# EAGLE design flashykomal (EAGLE 9.1.3)
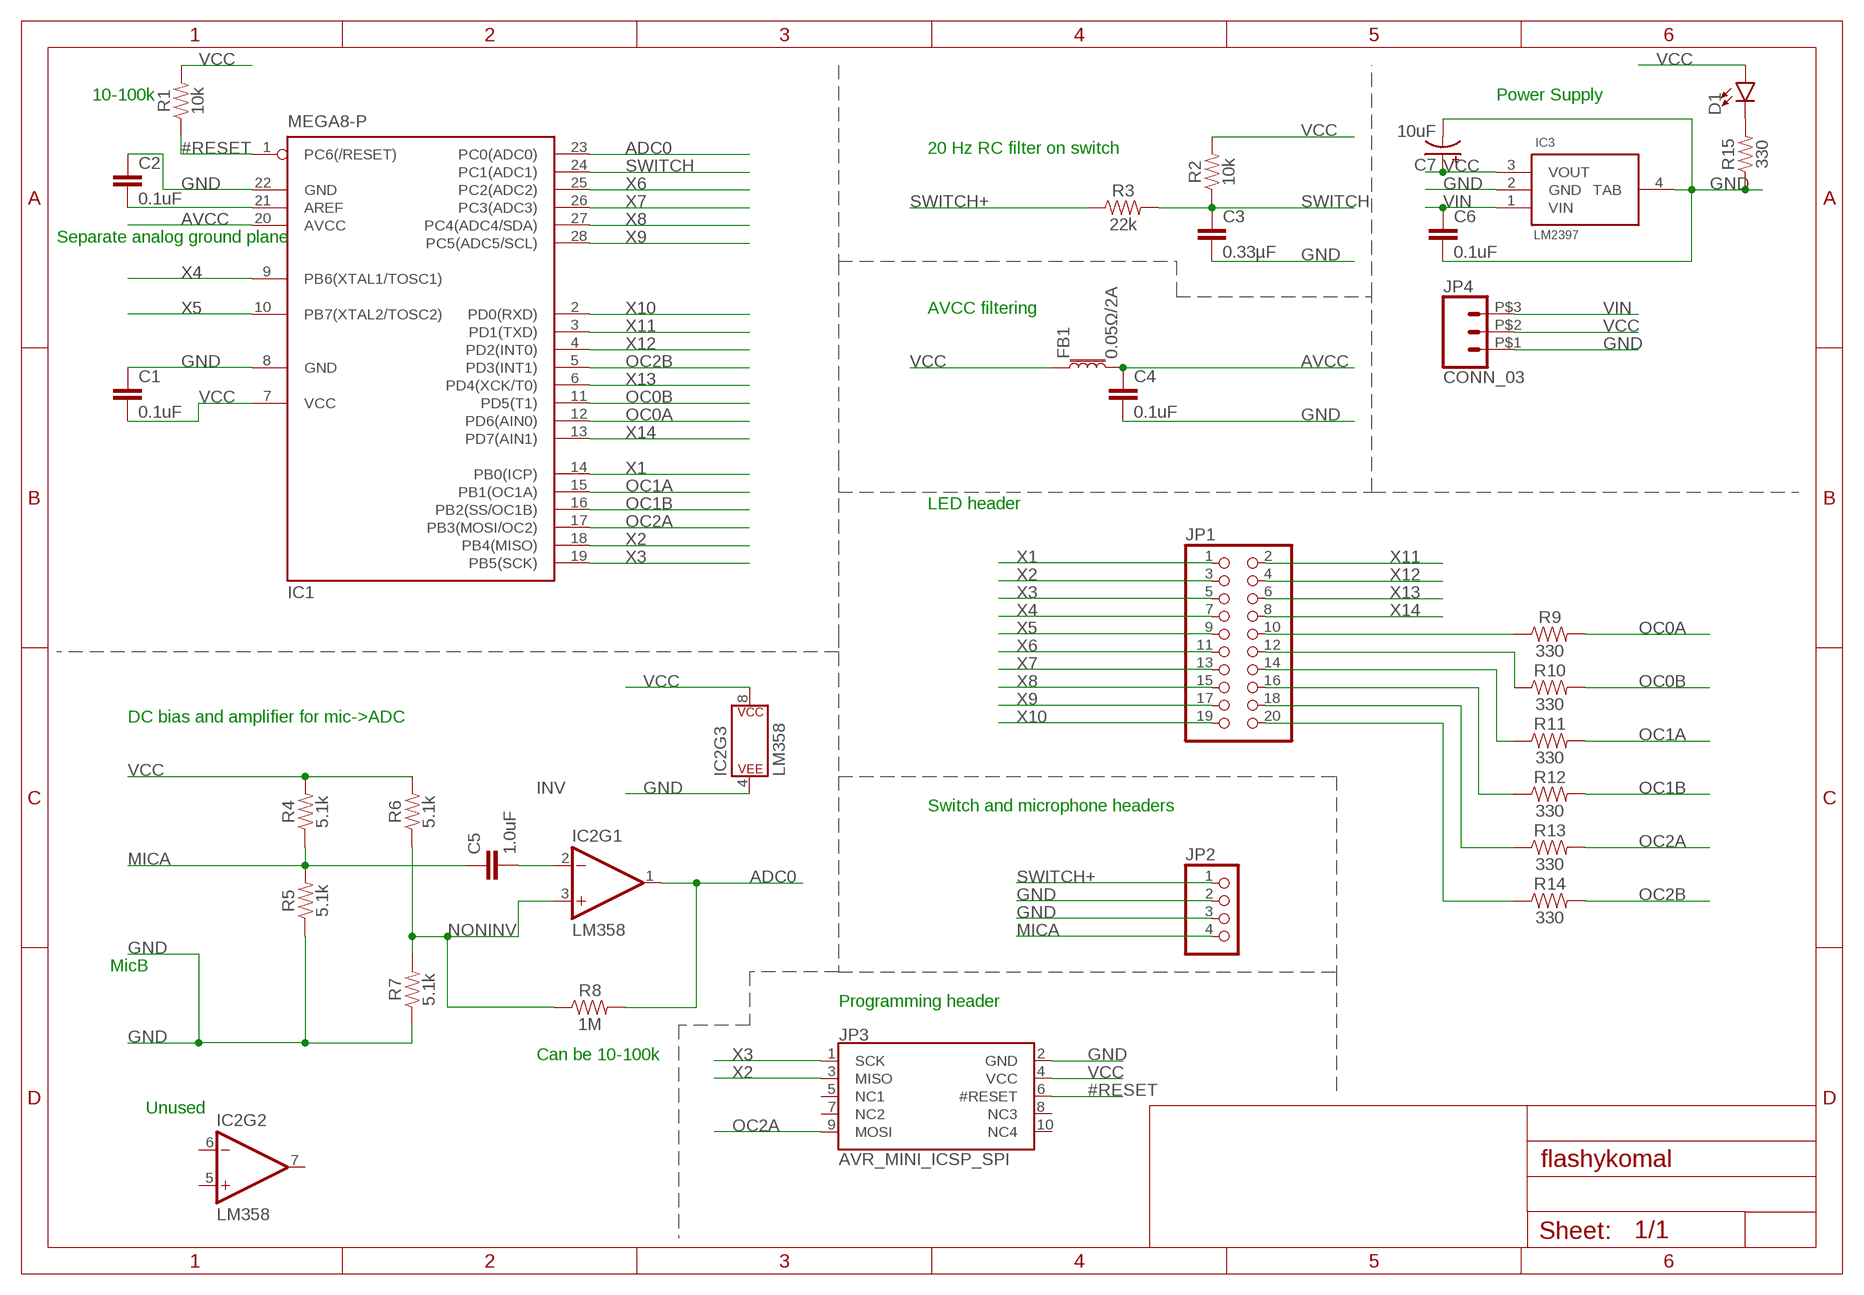
[diagram p0: schematic, sheet 1]

## Parts
C1  0.1uF  0.1UF-0603-25V-(+80/-20%)  [0603]
C2  0.1uF  0.1UF-0603-25V-(+80/-20%)  [0603]
C3  0.33µF  0.33UF/330NF-0805-50V-10%  [0805]
C4  0.1uF  0.1UF-0603-25V-(+80/-20%)  [0603]
C5  1.0uF  1.0UF-0603-16V-10%  [0603]
C6  0.1uF  0.1UF-0603-25V-(+80/-20%)  [0603]
C7  10uF  10UF-POLAR-RADIAL-2.5MM-25V-20%  [CPOL-RADIAL-2.5MM-5MM]
D1  LED0603  [LED-0603]
FB1  0.05Ω/2A  FERRITE_BEAD-0603  [0603]
IC1  MEGA8-P  [DIL28-3]
IC2  LM358  [DIP08]
IC3  LM2397  [SOT223]
JP1  PINHD-2X10  [2X10]
JP2  PINHD-1X4  [1X04]
JP3  AVR_MINI_ICSP_SPI  [SAMTECH_FTSH-105-01]
JP4  CONN_03  [PH1X3-381]
R1  10k  10KOHM-0603-1/10W-1%  [0603]
R2  10k  10KOHM-0603-1/10W-1%  [0603]
R3  22k  22KOHM-0603-1/10W-1%  [0603]
R4  5.1k  5.1KOHM5.1KOHM-0603-1/10W-1%  [0603]
R5  5.1k  5.1KOHM5.1KOHM-0603-1/10W-1%  [0603]
R6  5.1k  5.1KOHM5.1KOHM-0603-1/10W-1%  [0603]
R7  5.1k  5.1KOHM5.1KOHM-0603-1/10W-1%  [0603]
R8  1M  1MOHM-0603-1/4W-5%  [0603]
R9  330  330OHM-0603-1/10W-1%  [0603]
R10  330  330OHM-0603-1/10W-1%  [0603]
R11  330  330OHM-0603-1/10W-1%  [0603]
R12  330  330OHM-0603-1/10W-1%  [0603]
R13  330  330OHM-0603-1/10W-1%  [0603]
R14  330  330OHM-0603-1/10W-1%  [0603]
R15  330  330OHM-0603-1/10W-1%  [0603]

## Nets
#RESET: IC1.1(PC6(/RESET)) JP3.6(#RESET) R1.1
ADC0: IC1.23(PC0(ADC0)) IC2.1(OUT) R8.2
AVCC: C4.1 FB1.2 IC1.20(AVCC)
GND: C1.1 C2.1 C3.2 C4.2 C6.2 C7.2(-) IC1.8(GND) IC1.22(GND) IC2.4(P$V-) IC3.2(GND) IC3.4(TAB) JP2.2 JP2.3 JP3.2(GND) JP4.P$1 R5.1 R7.1 R15.1
INV: C5.2 IC2.2(-IN)
MICA: C5.1 JP2.4 R4.1 R5.2
N$1: D1.C R15.2
N$2: C2.2 IC1.21(AREF)
N$17: JP1.10 R9.1
N$18: JP1.12 R10.1
N$19: JP1.14 R11.1
N$20: JP1.16 R12.1
N$21: JP1.18 R13.1
N$22: JP1.20 R14.1
NONINV: IC2.3(+IN) R6.1 R7.2 R8.1
OC0A: IC1.12(PD6(AIN0)) R9.2
OC0B: IC1.11(PD5(T1)) R10.2
OC1A: IC1.15(PB1(OC1A)) R11.2
OC1B: IC1.16(PB2(SS/OC1B)) R12.2
OC2A: IC1.17(PB3(MOSI/OC2)) JP3.9(MOSI) R13.2
OC2B: IC1.5(PD3(INT1)) R14.2
SWITCH: C3.1 IC1.24(PC1(ADC1)) R2.1 R3.2
SWITCH+: JP2.1 R3.1
VCC: C1.2 C7.1(+) D1.A FB1.1 IC1.7(VCC) IC2.8(P$V+) IC3.3(VOUT) JP3.4(VCC) JP4.P$2 R1.2 R2.2 R4.2 R6.2
VIN: C6.1 IC3.1(VIN) JP4.P$3
X1: IC1.14(PB0(ICP)) JP1.1
X2: IC1.18(PB4(MISO)) JP1.3 JP3.3(MISO)
X3: IC1.19(PB5(SCK)) JP1.5 JP3.1(SCK)
X4: IC1.9(PB6(XTAL1/TOSC1)) JP1.7
X5: IC1.10(PB7(XTAL2/TOSC2)) JP1.9
X6: IC1.25(PC2(ADC2)) JP1.11
X7: IC1.26(PC3(ADC3)) JP1.13
X8: IC1.27(PC4(ADC4/SDA)) JP1.15
X9: IC1.28(PC5(ADC5/SCL)) JP1.17
X10: IC1.2(PD0(RXD)) JP1.19
X11: IC1.3(PD1(TXD)) JP1.2
X12: IC1.4(PD2(INT0)) JP1.4
X13: IC1.6(PD4(XCK/T0)) JP1.6
X14: IC1.13(PD7(AIN1)) JP1.8
Unconnected: IC2.5(+IN) IC2.6(-IN) IC2.7(OUT) JP3.5(NC1) JP3.7(NC2) JP3.8(NC3) JP3.10(NC4)

## Notes on the sheet
- 10-100k | Power Supply
- 20 Hz RC filter on switch
- Separate analog ground plane
- AVCC filtering
- LED header
- DC bias and amplifier for mic->ADC
- Switch and microphone headers
- MicB
- Programming header
- Can be 10-100k
- Unused

## Library data of the parts
C1 C2 C4 C6 = SparkFun-Capacitors:0.1UF: 0.1µF ceramic capacitors A capacitor is a passive two-terminal electrical component used to store electrical energy temporarily in an electric field.; PROD_ID: CAP-00810
C3 = SparkFun-Capacitors:0.33UF/330NF: 0.33µF/330nF ceramic capacitors A capacitor is a passive two-terminal electrical component used to store electrical energy temporarily in an electric field.; PROD_ID: CAP-08469
C5 = SparkFun-Capacitors:1.0UF: 1µF ceramic capacitors A capacitor is a passive two-terminal electrical component used to store electrical energy temporarily in an electric field.; PROD_ID: CAP-00868
C7 = SparkFun-Capacitors:10UF-POLAR: 10.0µF polarized capacitors A capacitor is a passive two-terminal electrical component used to store electrical energy temporarily in an electric field.; PROD_ID: CAP-08440
D1 = SparkFun-LED:LED: LED (Generic) Standard schematic elements and footprints for 5mm, 3mm, 1206, and 0603 sized LEDs. Generic LEDs with no color specified.
FB1 = SparkFun-Coils:FERRITE_BEAD: Ferrite Bead (blocks, cores, rings, chokes, etc.) Inductor with layers of ferrite used to suppress high frequencies. Often used to isolate high frequency noise. SparkFun Products: IOIO-OTG - V2.2 <https://www.sparkfun.com/products/13613> SparkFun SAMD21 Mini Breakout <https://www.sparkfun.com/products/13664> SparkFun 6 Degrees of Freedom Breakout - LSM6DS3 <https://www.sparkfun.com/products/13339> SparkFun SAMD21 Dev Breakout <https://www.sparkfun.com/products/13672>; PROD_ID: NDUC-13805; VALUE: 30Ω/1.8A
IC1 = atmel:MEGA8-P: MICROCONTROLLER 8 Kbytes FLASH, 1 kbytes SRAM, 512 bytes EEPROM, USART, 4-channel 10 bit ADC, 2-channel 8 bit ADC Pin compatible with Atmega48, ATMega88, ATMega168 Source: avr.lbr; OC_FARNELL: unknown; OC_NEWARK: unknown
IC2 = SparkFun-IC-Amplifiers:LM358: LM358 Jellybean op-amp Datasheet <http://www.sparkfun.com/datasheets/Components/General/LM358.pdf> SparkFun Products Op-Amp (Thru-Hole) - LM358 <https://www.sparkfun.com/products/9456> (COM-09456); PROD_ID: IC-09172
IC3 = atmel-samd:LM2397
JP1 = pinhead:PINHD-2X10: PIN HEADER
JP2 = pinhead:PINHD-1X4: PIN HEADER
JP3 = atmel-samd:AVR_MINI_ICSP_SPI
JP4 = atmel-samd:CONN_03
R1 R2 = SparkFun-Resistors:10KOHM: 10kΩ resistor A resistor is a passive two-terminal electrical component that implements electrical resistance as a circuit element. Resistors act to reduce current flow, and, at the same time, act to lower voltage levels within circuits. - Wikipedia; PROD_ID: RES-00824
R3 = SparkFun-Resistors:22KOHM: 22kΩ resistor A resistor is a passive two-terminal electrical component that implements electrical resistance as a circuit element. Resistors act to reduce current flow, and, at the same time, act to lower voltage levels within circuits. - Wikipedia; PROD_ID: RES-07853
R4-R7 = SparkFun-Resistors:5.1KOHM; PROD_ID: RES-12083
R8 = SparkFun-Resistors:1MOHM: 1MΩ resistor A resistor is a passive two-terminal electrical component that implements electrical resistance as a circuit element. Resistors act to reduce current flow, and, at the same time, act to lower voltage levels within circuits. - Wikipedia; PROD_ID: RES-07868
R9-R15 = SparkFun-Resistors:330OHM: 330Ω resistor A resistor is a passive two-terminal electrical component that implements electrical resistance as a circuit element. Resistors act to reduce current flow, and, at the same time, act to lower voltage levels within circuits. - Wikipedia; PROD_ID: RES-00818

## Net classes
0 default: width 0.254 mm

## Board
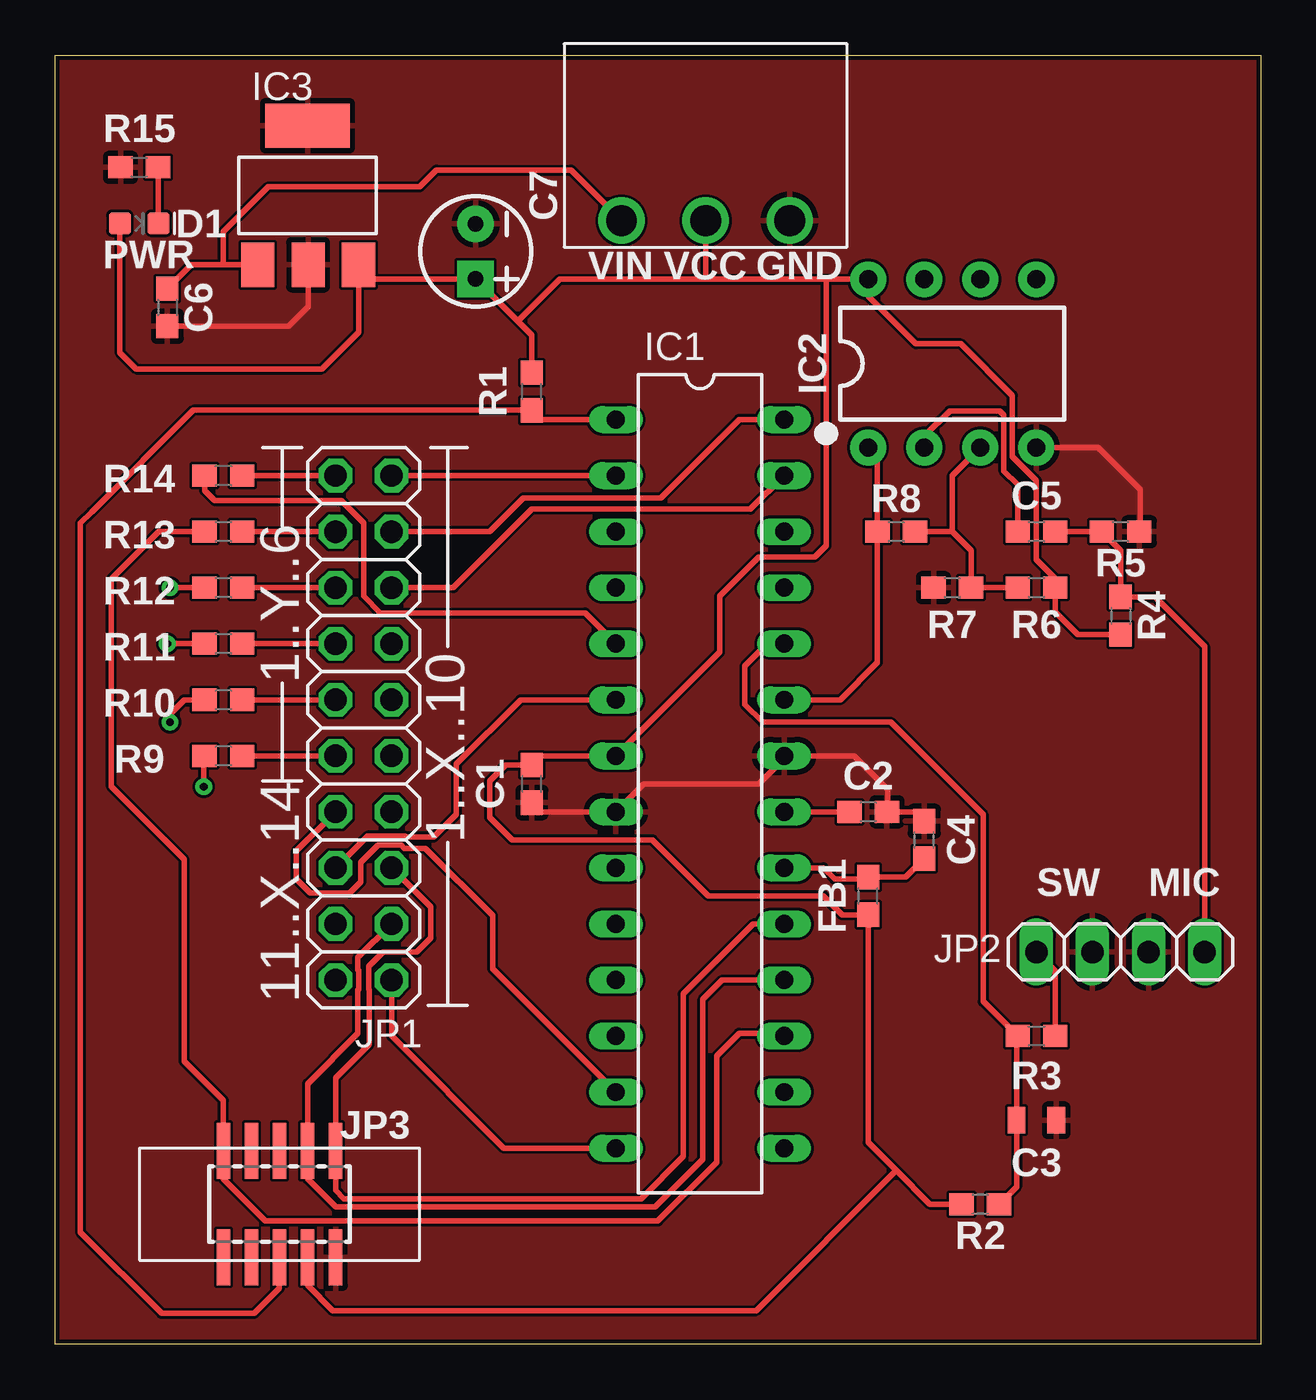
[diagram p1: board, top side]
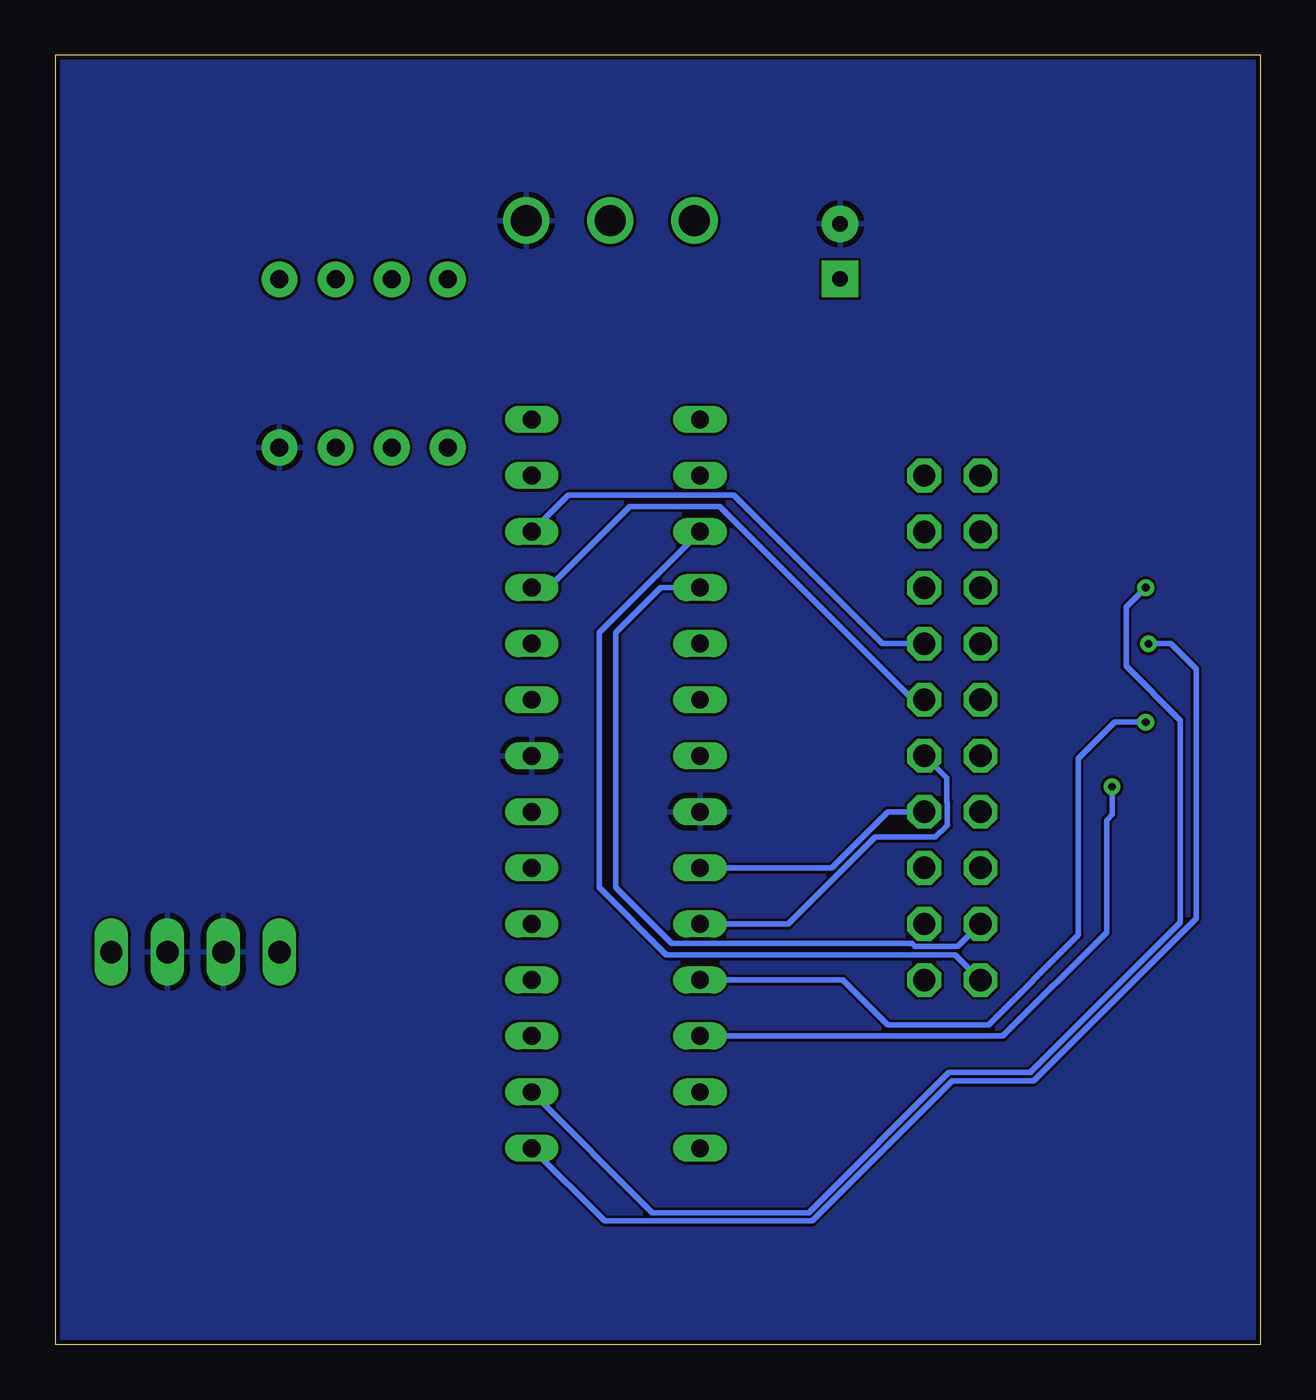
[diagram p2: board, bottom side, seen from below]

Size 54.61 x 58.42 mm. Coordinates in mm from the lower left corner, seen from the top.
Outline: 0,0 0,58.42 54.61,58.42 54.61,0 0,0
Copper layers (1*16): Top 0.035mm / dielectric 1.5mm / Bottom 0.035mm
Design rules "jlcpcb": minimum track width 5mil, minimum drill 0.3mm, track to track 5mil, track to pad 5mil, pad to pad 5mil, via to via 5mil, smd to smd 5mil, copper to edge 0.2mm, drill to drill 6mil, minimum pad ring 3mil, minimum via ring 8mil, stop-mask expansion 0mil, vias tented up to drill 15mil, thermal gap 10mil

### Footprints (pad centres in the part's own frame; a part is rotated, then mirrored left to right if it is on the bottom)
0603 = smd 1.1 x 1: 1 -0.85,0; 2 0.85,0
0805 = smd 0.8 x 1.2: 1 -0.9,0; 2 0.9,0
CPOL-RADIAL-2.5MM-5MM = drill 0.7 pad 1.651 square: 1 1.25,0 | drill 0.7 pad 1.651: 2 -1.25,0
LED-0603 = smd 1 x 1: A -0.877,0; C 0.877,0
DIL28-3 = drill 0.813 long: 1 -16.51,-3.81; 2 -13.97,-3.81; 3 -11.43,-3.81; 4 -8.89,-3.81; 5 -6.35,-3.81; 6 -3.81,-3.81; 7 -1.27,-3.81; 8 1.27,-3.81; 9 3.81,-3.81; 10 6.35,-3.81; 11 8.89,-3.81; 12 11.43,-3.81; 13 13.97,-3.81; 14 16.51,-3.81; 15 16.51,3.81; 16 13.97,3.81; 17 11.43,3.81; 18 8.89,3.81; 19 6.35,3.81; 20 3.81,3.81; 21 1.27,3.81; 22 -1.27,3.81; 23 -3.81,3.81; 24 -6.35,3.81; 25 -8.89,3.81; 26 -11.43,3.81; 27 -13.97,3.81; 28 -16.51,3.81
DIP08 = drill 0.813 pad 1.626: 1 -3.81,-3.81; 2 -1.27,-3.81; 3 1.27,-3.81; 4 3.81,-3.81; 5 3.81,3.81; 6 1.27,3.81; 7 -1.27,3.81; 8 -3.81,3.81
SOT223 = smd 1.499 x 2.007: 1 -2.261,-3.15; 2 0.025,-3.15; 3 2.311,-3.15 | smd 3.81 x 2.007: 4 0,3.15
2X10 = drill 1.016 octagon: 1 -11.43,-1.27; 2 -11.43,1.27; 3 -8.89,-1.27; 4 -8.89,1.27; 5 -6.35,-1.27; 6 -6.35,1.27; 7 -3.81,-1.27; 8 -3.81,1.27; 9 -1.27,-1.27; 10 -1.27,1.27; 11 1.27,-1.27; 12 1.27,1.27; 13 3.81,-1.27; 14 3.81,1.27; 15 6.35,-1.27; 16 6.35,1.27; 17 8.89,-1.27; 18 8.89,1.27; 19 11.43,-1.27; 20 11.43,1.27
1X04 = drill 1.016 long: 1 -3.81,0; 2 -1.27,0; 3 1.27,0; 4 3.81,0
SAMTECH_FTSH-105-01 = smd 0.61 x 2.54: 1 -2.54,-2.413; 2 -2.54,2.413; 3 -1.27,-2.413; 4 -1.27,2.413; 5 0,-2.413; 6 0,2.413; 7 1.27,-2.413; 8 1.27,2.413; 9 2.54,-2.413; 10 2.54,2.413
PH1X3-381 = drill 1.4: P$1 -3.81,0; P$2 0,0; P$3 3.81,0

### Placement (x,y rotation side)
C1  21.59,25.4 90 top
C2  36.83,24.13 180 top
C3  44.45,10.16 0 top
C4  39.37,22.86 90 top
C5  44.45,36.83 180 top
C6  5.08,46.99 270 top
C7  19.05,49.53 270 top
D1  3.81,50.8 0 top
FB1  36.83,20.32 90 top
IC1  29.21,25.4 270 top
IC2  40.64,44.45 0 top
IC3  11.43,52.07 0 top
JP1  13.97,27.94 90 top
JP2  48.26,17.78 0 top
JP3  10.16,6.35 180 top
JP4  29.46,50.93 180 top
R1  21.59,43.18 90 top
R2  41.91,6.35 180 top
R3  44.45,13.97 180 top
R4  48.26,33.02 270 top
R5  48.26,36.83 180 top
R6  44.45,34.29 0 top
R7  40.64,34.29 0 top
R8  38.1,36.83 180 top
R9  7.62,26.67 180 top
R10  7.62,29.21 180 top
R11  7.62,31.75 180 top
R12  7.62,34.29 180 top
R13  7.62,36.83 180 top
R14  7.62,39.37 180 top
R15  3.81,53.34 0 top

### Tracks (layer width: path | path; a pad name or v marks a point on that pad's centre or on a via)
#RESET
  Top 0.254: IC1.1 22.01,41.91 R1.1 6.26,42.33 1.65,37.72 1.14,37.21 1.14,5.08 4.83,1.4 9.02,1.4 10.16,2.54 JP3.6
ADC0
  Top 0.254: IC2.1 37.25,40.22 R8.2 37.25,30.9 35.56,29.21 IC1.23
AVCC
  Top 0.254: IC1.20 34.8,21.59 35.31,21.08 36.74,21.08 FB1.2 38.53,21.17 C4.1
GND
  Top 0.254: C6.2 10.58,46.14 11.46,47.02 IC3.2 | IC2.4 47.24,40.64 49.15,38.73 49.15,36.87 R5.1 | C4.2 38.95,24.13 37.72,24.13 | 37.72,24.13 C2.1 | IC1.22 33.15,26.67 | 33.15,26.67 36.2,26.67 37.72,25.15 37.72,24.13 | C1.1 22.01,24.13 IC1.8 26.67,25.4 31.88,25.4 33.15,26.67
  pour Top: -1.78,58.8 54.61,58.8 54.61,-1.27 54.61,-3.81 -2.54,-3.81 -2.54,58.42 -1.27,58.42
  pour Bottom: -2.54,58.42 54.61,58.42 54.61,-3.81 -2.54,-3.81
INV
  Top 0.254: C5.2 43.6,38.95 42.98,39.57 42.98,42.11 42.8,42.29 40.51,42.29 39.37,41.15 IC2.2
MICA
  Top 0.254: C5.1 R5.2 48.26,35.98 R4.1 49.82,33.87 52.07,31.62 JP2.4
N$1
  Top 0.254: R15.2 4.66,50.8 D1.C
N$2
  Top 0.254: C2.2 IC1.21
N$17
  Top 0.254: R9.1 JP1.10
N$18
  Top 0.254: R10.1 JP1.12
N$19
  Top 0.254: R11.1 JP1.14
N$20
  Top 0.254: R12.1 JP1.16
N$21
  Top 0.254: R13.1 JP1.18
N$22
  Top 0.254: R14.1 JP1.20
NONINV
  Top 0.254: R6.1 R7.2 41.49,35.98 40.64,36.83 | R8.1 40.64,36.83 | IC2.3 40.64,39.37 40.64,36.83
OC0A  (via drill 0.35)
  Top 0.254: v6.73,25.27 6.73,26.63 R9.2
  Bottom 0.254: IC1.12 11.68,13.97 6.99,18.67 6.99,23.75 6.73,24 v6.73,25.27
OC0B  (via drill 0.35)
  Top 0.254: v5.21,28.19 5.21,28.57 5.84,29.21 R10.2
  Bottom 0.254: IC1.11 18.92,16.51 16.89,14.48 12.32,14.48 8.26,18.54 8.26,26.54 6.6,28.19 v5.21,28.19
OC1A  (via drill 0.35)
  Top 0.254: v5.08,31.75 R11.2
  Bottom 0.254: IC1.15 29.72,5.59 20.32,5.59 13.97,11.94 10.29,11.94 2.92,19.3 2.92,30.61 4.06,31.75 v5.08,31.75
OC1B  (via drill 0.35)
  Top 0.254: v5.21,34.29 R12.2
  Bottom 0.254: IC1.16 27.56,5.97 20.48,5.97 14.13,12.32 10.45,12.32 3.63,19.13 3.63,28.27 6.1,30.73 6.1,33.4 v5.21,34.29
OC2A
  Top 0.254: R13.2 4.7,36.83 2.54,34.67 2.54,25.27 5.84,21.97 5.84,12.83 7.62,11.05 JP3.9 7.62,7.49 9.53,5.59 27.3,5.59 29.97,8.26 29.97,13.08 30.99,14.1 32.89,14.1 IC1.17
OC2B
  Top 0.254: R14.2 6.77,38.7 7.24,38.23 12.95,38.23 13.97,37.21 13.97,33.91 14.73,33.15 24,33.15 IC1.5
SWITCH
  Top 0.254: R2.1 43.55,7.14 C3.1 43.55,13.92 R3.2 42.04,15.53 42.04,24 37.85,28.19 32.05,28.19 31.24,29 31.24,30.73 32.26,31.75 IC1.24
SWITCH+
  Top 0.254: JP2.1 45.3,16.93 R3.1
VCC
  Top 0.254: 20.96,46.37 C7.1 14.38,48.28 IC3.3 13.74,45.87 12.06,44.2 3.68,44.2 2.93,44.95 D1.A | 20.96,46.37 21.59,45.74 R1.2 | 20.96,46.37 22.86,48.26 29.46,48.26 | 29.46,48.26 34.92,48.26 | 34.92,48.26 IC2.8 36.83,47.5 38.99,45.34 41.02,45.34 43.36,43 43.36,40.22 44.45,39.13 44.45,35.56 45.3,34.71 R6.2 45.3,33.19 46.32,32.17 R4.2 | 38.1,7.87 36.83,9.14 FB1.1 35.65,19.47 34.8,20.32 29.59,20.32 27.05,22.86 20.7,22.86 19.68,23.88 19.68,25.53 20.41,26.25 C1.2 22.01,26.67 IC1.7 30.1,31.37 30.1,33.91 31.88,35.69 34.42,35.69 34.92,36.2 34.92,48.26 | 38.1,7.87 39.62,6.35 R2.2 | JP3.4 11.43,2.67 12.57,1.52 31.75,1.52 38.1,7.87 | JP4.P$2 29.46,48.26
VIN
  Top 0.254: C6.1 6.16,48.92 7.62,48.92 | 7.62,48.92 IC3.1 | 7.62,48.92 7.62,50.42 9.65,52.45 16.51,52.45 17.27,53.21 23.37,53.21 JP4.P$3
X1
  Top 0.254: IC1.14 20.32,8.89 15.24,13.97 JP1.1
X2
  Top 0.254: JP1.3 13.72,17.53 13.72,16.97 13.74,16.94 13.74,16.08 13.72,16.05 13.72,14.1 11.43,11.81 JP3.3 11.43,7.49 12.7,6.22 27.18,6.22 29.34,8.38 29.34,15.62 30.23,16.51 IC1.18
X3
  Top 0.254: JP1.5 17.02,19.81 17.02,18.41 16.38,17.78 14.86,17.78 14.2,17.12 14.2,16.08 14.22,16.05 14.22,13.59 12.7,12.06 JP3.1 12.7,6.99 13.08,6.6 26.54,6.6 28.45,8.51 28.45,15.88 31.62,19.05 IC1.19
X4
  Bottom 0.254: IC1.9 19.43,21.59 16.89,24.13 JP1.7
X5
  Bottom 0.254: IC1.10 21.4,19.05 17.46,22.99 14.73,22.99 14.2,23.52 14.2,24.56 14.22,24.59 14.22,25.65 JP1.9
X6
  Bottom 0.254: JP1.11 15.75,29.21 24.51,37.97 28.57,37.97 32.26,34.29 IC1.25
X7
  Bottom 0.254: JP1.13 17.14,31.75 23.88,38.48 31.37,38.48 IC1.26
X8
  Top 0.254: IC1.27 31.5,37.85 21.59,37.85 18.03,34.29 JP1.15
X9
  Top 0.254: IC1.28 30.99,41.91 27.43,38.35 21.21,38.35 19.68,36.83 JP1.17
X10
  Top 0.254: IC1.2 JP1.19
X11
  Bottom 0.254: IC1.3 29.97,32.26 29.97,20.7 26.92,17.65 13.84,17.65 JP1.2
X12
  Bottom 0.254: IC1.4 27.18,34.29 29.21,32.26 29.21,20.7 26.67,18.16 15.79,18.16 15.66,18.03 13.72,18.03 JP1.4
X13
  Top 0.254: IC1.6 21.08,29.21 18.16,26.29 18.16,24 17.14,22.99 15.89,22.99 15.84,23.04 14.15,23.04 JP1.6
X14
  Top 0.254: IC1.13 19.81,17.02 19.81,19.43 16.76,22.48 15.82,22.48 15.67,22.63 14.63,22.63 13.84,21.84 13.84,20.95 13.34,20.45 11.56,20.45 10.92,21.08 10.92,22.35 JP1.8

### Text on the board
tNames: PWR | VIN | VCC | GND | 1..Y..6 | 1..X..10 | SW | MIC | 11..X..14